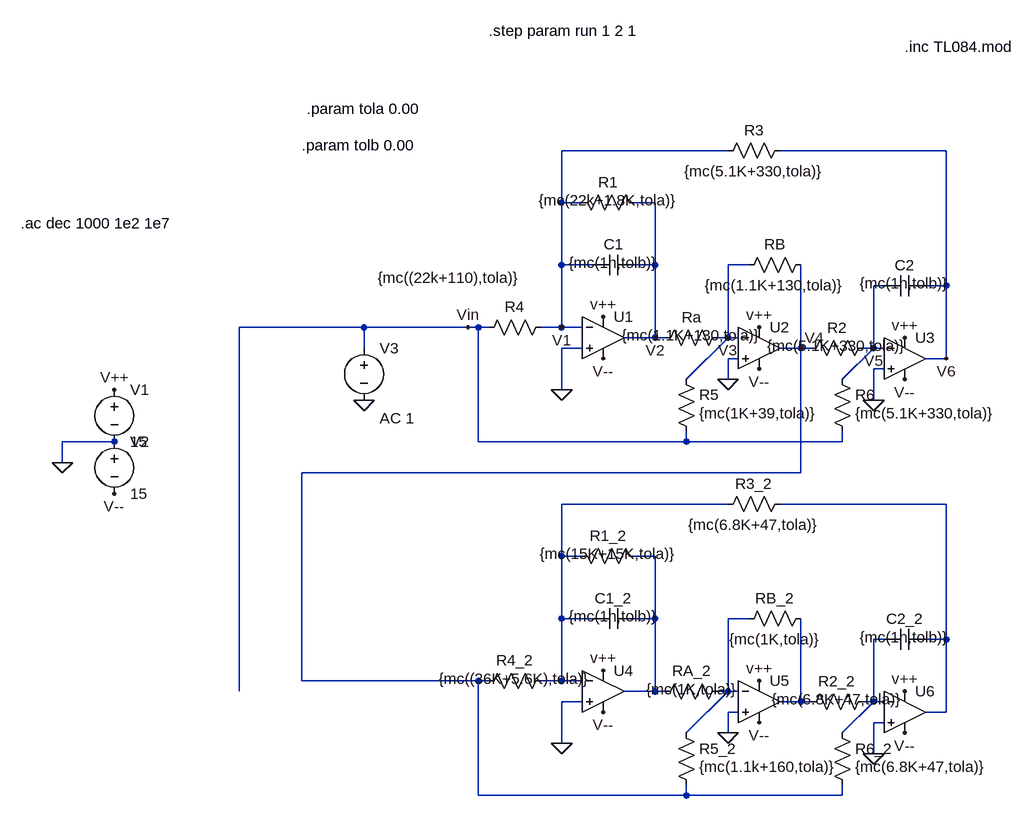
[diagram p0: schematic Fleisher_Tow_1_sin_montec.asc]
Fleisher_Tow_1_sin_montec.asc, the LTspice schematic file:
Version 4
SHEET 1 936 904
WIRE 176 -96 -80 -96
WIRE 512 -96 256 -96
WIRE -80 -16 -80 -96
WIRE -48 -16 -80 -16
WIRE 64 -16 32 -16
WIRE -80 80 -80 -16
WIRE -32 80 -80 80
WIRE 64 80 64 -16
WIRE 64 80 32 80
WIRE 208 80 176 80
WIRE 416 112 400 112
WIRE 512 112 512 -96
WIRE 512 112 480 112
WIRE -384 176 -576 176
WIRE -224 176 -384 176
WIRE -208 176 -224 176
WIRE -192 176 -208 176
WIRE -80 176 -80 80
WIRE -80 176 -112 176
WIRE -48 176 -80 176
WIRE 64 192 64 80
WIRE 64 192 16 192
WIRE 80 192 64 192
WIRE 176 192 176 80
WIRE 176 192 160 192
WIRE 192 192 176 192
WIRE -384 208 -384 176
WIRE -48 208 -80 208
WIRE 288 208 288 80
WIRE 288 208 256 208
WIRE 304 208 288 208
WIRE 400 208 400 112
WIRE 400 208 384 208
WIRE 416 208 400 208
WIRE 192 224 176 224
WIRE 512 224 512 112
WIRE 512 224 480 224
WIRE 416 240 400 240
WIRE 112 256 176 192
WIRE 176 256 176 224
WIRE 352 256 400 208
WIRE -80 272 -80 208
WIRE 400 288 400 240
WIRE -768 352 -848 352
WIRE -208 352 -208 176
WIRE 112 352 112 336
WIRE 112 352 -208 352
WIRE 352 352 352 336
WIRE 352 352 112 352
WIRE -848 384 -848 352
WIRE 288 400 288 208
WIRE 288 400 -480 400
WIRE 176 448 -80 448
WIRE 512 448 256 448
WIRE -80 528 -80 448
WIRE -48 528 -80 528
WIRE 64 528 32 528
WIRE -80 624 -80 528
WIRE -32 624 -80 624
WIRE 64 624 64 528
WIRE 64 624 32 624
WIRE 208 624 176 624
WIRE 416 656 400 656
WIRE 512 656 512 448
WIRE 512 656 480 656
WIRE -480 720 -480 400
WIRE -208 720 -480 720
WIRE -192 720 -208 720
WIRE -80 720 -80 624
WIRE -80 720 -112 720
WIRE -48 720 -80 720
WIRE -576 736 -576 176
WIRE 64 736 64 624
WIRE 64 736 16 736
WIRE 80 736 64 736
WIRE 176 736 176 624
WIRE 176 736 160 736
WIRE 192 736 176 736
WIRE -48 752 -80 752
WIRE 288 752 288 624
WIRE 288 752 256 752
WIRE 304 752 288 752
WIRE 400 752 400 656
WIRE 400 752 384 752
WIRE 416 752 400 752
WIRE 192 768 176 768
WIRE 512 768 512 656
WIRE 512 768 480 768
WIRE 416 784 400 784
WIRE 112 800 176 736
WIRE 176 800 176 768
WIRE 352 800 400 752
WIRE -80 816 -80 752
WIRE 400 832 400 784
WIRE -208 896 -208 720
WIRE 112 896 112 880
WIRE 112 896 -208 896
WIRE 352 896 352 880
WIRE 352 896 112 896
FLAG 400 288 0
FLAG -80 272 0
FLAG 176 256 0
FLAG -224 176 Vin
FLAG -80 176 V1
FLAG 64 192 V2
FLAG 176 192 V3
FLAG 288 208 V4
FLAG 400 208 V5
FLAG 512 224 V6
FLAG -848 384 0
FLAG -768 272 V++
FLAG -768 432 V--
FLAG -16 160 v++
FLAG -16 224 V--
FLAG 224 176 v++
FLAG 224 240 V--
FLAG 448 192 v++
FLAG 448 256 V--
FLAG -384 288 0
FLAG 400 832 0
FLAG -80 816 0
FLAG 176 800 0
FLAG -16 704 v++
FLAG -16 768 V--
FLAG 224 720 v++
FLAG 224 784 V--
FLAG 448 736 v++
FLAG 448 800 V--
SYMBOL res -96 160 R90
WINDOW 0 0 56 VBottom 2
WINDOW 3 -45 156 VBottom 2
SYMATTR InstName R4
SYMATTR Value {mc((22k+110),tola)}
SYMBOL res -64 -32 M90
WINDOW 0 0 56 VBottom 2
WINDOW 3 28 56 VBottom 2
SYMATTR InstName R1
SYMATTR Value {mc(22k+1.8K,tola)}
SYMBOL cap -32 64 M90
WINDOW 0 0 32 VBottom 2
WINDOW 3 28 32 VBottom 2
SYMATTR InstName C1
SYMATTR Value {mc(1n,tolb)}
SYMBOL res 400 192 R90
WINDOW 0 0 56 VBottom 2
WINDOW 3 28 56 VBottom 2
SYMATTR InstName R2
SYMATTR Value {mc(5.1K+330,tola)}
SYMBOL cap 480 96 R90
WINDOW 0 0 32 VBottom 2
WINDOW 3 28 32 VBottom 2
SYMATTR InstName C2
SYMATTR Value {mc(1n,tolb)}
SYMBOL res 176 176 R90
WINDOW 0 0 56 VBottom 2
WINDOW 3 28 56 VBottom 2
SYMATTR InstName Ra
SYMATTR Value {mc(1.1K+130,tola)}
SYMBOL res 96 240 R0
WINDOW 3 36 68 Left 2
SYMATTR Value {mc(1K+39,tola)}
SYMATTR InstName R5
SYMBOL res 336 240 R0
WINDOW 3 36 68 Left 2
SYMATTR Value {mc(5.1K+330,tola)}
SYMATTR InstName R6
SYMBOL voltage -768 256 R0
WINDOW 123 0 0 Left 2
WINDOW 39 0 0 Left 2
SYMATTR InstName V1
SYMATTR Value 15
SYMBOL voltage -768 336 R0
WINDOW 123 0 0 Left 2
WINDOW 39 0 0 Left 2
SYMATTR InstName V2
SYMATTR Value 15
SYMBOL Opamps\\opamp2 -16 128 R0
SYMATTR InstName U1
SYMATTR Value ""
SYMATTR SpiceModel TL084
SYMBOL Opamps\\opamp2 224 144 R0
SYMATTR InstName U2
SYMATTR Value ""
SYMATTR SpiceModel TL084
SYMBOL Opamps\\opamp2 448 160 R0
SYMATTR InstName U3
SYMATTR Value ""
SYMATTR SpiceModel TL084
SYMBOL voltage -384 192 R0
WINDOW 123 24 124 Left 2
WINDOW 39 0 0 Left 2
SYMATTR Value2 AC 1
SYMATTR InstName V3
SYMATTR Value ""
SYMBOL res 272 -112 R90
WINDOW 0 0 56 VBottom 2
WINDOW 3 32 56 VTop 2
SYMATTR InstName R3
SYMATTR Value {mc(5.1K+330,tola)}
SYMBOL res 304 64 R90
WINDOW 0 0 56 VBottom 2
WINDOW 3 32 56 VTop 2
SYMATTR InstName RB
SYMATTR Value {mc(1.1K+130,tola)}
SYMBOL res -96 704 R90
WINDOW 0 0 56 VBottom 2
WINDOW 3 28 56 VBottom 2
SYMATTR InstName R4_2
SYMATTR Value {mc((36K+5.6K),tola)}
SYMBOL res -64 512 M90
WINDOW 0 0 56 VBottom 2
WINDOW 3 28 56 VBottom 2
SYMATTR InstName R1_2
SYMATTR Value {mc(15K+15K,tola)}
SYMBOL cap -32 608 M90
WINDOW 0 0 32 VBottom 2
WINDOW 3 28 32 VBottom 2
SYMATTR InstName C1_2
SYMATTR Value {mc(1n,tolb)}
SYMBOL res 400 736 R90
WINDOW 0 0 56 VBottom 2
WINDOW 3 28 56 VBottom 2
SYMATTR InstName R2_2
SYMATTR Value {mc(6.8K+47,tola)}
SYMBOL cap 480 640 R90
WINDOW 0 0 32 VBottom 2
WINDOW 3 28 32 VBottom 2
SYMATTR InstName C2_2
SYMATTR Value {mc(1n,tolb)}
SYMBOL res 176 720 R90
WINDOW 0 0 56 VBottom 2
WINDOW 3 28 56 VBottom 2
SYMATTR InstName RA_2
SYMATTR Value {mc(1K,tola)}
SYMBOL res 96 784 R0
WINDOW 3 36 68 Left 2
SYMATTR Value {mc(1.1k+160,tola)}
SYMATTR InstName R5_2
SYMBOL res 336 784 R0
WINDOW 3 36 68 Left 2
SYMATTR Value {mc(6.8K+47,tola)}
SYMATTR InstName R6_2
SYMBOL Opamps\\opamp2 -16 672 R0
SYMATTR InstName U4
SYMATTR Value ""
SYMATTR SpiceModel TL084
SYMBOL Opamps\\opamp2 224 688 R0
SYMATTR InstName U5
SYMATTR Value ""
SYMATTR SpiceModel TL084
SYMBOL Opamps\\opamp2 448 704 R0
SYMATTR InstName U6
SYMATTR Value ""
SYMATTR SpiceModel TL084
SYMBOL res 272 432 R90
WINDOW 0 0 56 VBottom 2
WINDOW 3 32 56 VTop 2
SYMATTR InstName R3_2
SYMATTR Value {mc(6.8K+47,tola)}
SYMBOL res 304 608 R90
WINDOW 0 0 56 VBottom 2
WINDOW 3 32 56 VTop 2
SYMATTR InstName RB_2
SYMATTR Value {mc(1K,tola)}
TEXT 448 -256 Left 2 !.inc TL084.mod
TEXT -912 16 Left 2 !.ac dec 1000 1e2 1e7
TEXT -472 -160 Left 2 !.param tola 0.00
TEXT -192 -280 Left 2 !.step param run 1 2 1
TEXT -480 -104 Left 2 !.param tolb 0.00

The netlist it stands for:
* Fleisher_Tow_1_sin_montec.asc
R4 V1 Vin {mc((22k+110),tola)}
R1 V1 V2 {mc(22k+1.8K,tola)}
C1 V1 V2 {mc(1n,tolb)}
R2 V5 V4 {mc(5.1K+330,tola)}
C2 V6 V5 {mc(1n,tolb)}
Ra V3 V2 {mc(1.1K+130,tola)}
R5 V3 Vin {mc(1K+39,tola)}
R6 V5 Vin {mc(5.1K+330,tola)}
V1 V++ 0 15
V2 0 V-- 15
XU1 0 V1 V++ V-- V2 TL084  ; pins In+ In- V+ V- OUT
XU2 0 V3 V++ V-- V4 TL084  ; pins In+ In- V+ V- OUT
XU3 0 V5 V++ V-- V6 TL084  ; pins In+ In- V+ V- OUT
V3 Vin 0 AC 1
R3 V6 V1 {mc(5.1K+330,tola)}
RB V4 V3 {mc(1.1K+130,tola)}
R4_2 N001 V4 {mc((36K+5.6K),tola)}
R1_2 N001 N003 {mc(15K+15K,tola)}
C1_2 N001 N003 {mc(1n,tolb)}
R2_2 N005 N006 {mc(6.8K+47,tola)}
C2_2 N002 N005 {mc(1n,tolb)}
RA_2 N004 N003 {mc(1K,tola)}
R5_2 N004 V4 {mc(1.1k+160,tola)}
R6_2 N005 V4 {mc(6.8K+47,tola)}
XU4 0 N001 V++ V-- N003 TL084  ; pins In+ In- V+ V- OUT
XU5 0 N004 V++ V-- N006 TL084  ; pins In+ In- V+ V- OUT
XU6 0 N005 V++ V-- N002 TL084  ; pins In+ In- V+ V- OUT
R3_2 N002 N001 {mc(6.8K+47,tola)}
RB_2 N006 N004 {mc(1K,tola)}
.inc TL084.mod
.ac dec 1000 1e2 1e7
.param tola 0.00
.step param run 1 2 1
.param tolb 0.00
.backanno
.end